# EAGLE design QuackDrive no usb power (EAGLE 9.5.1)
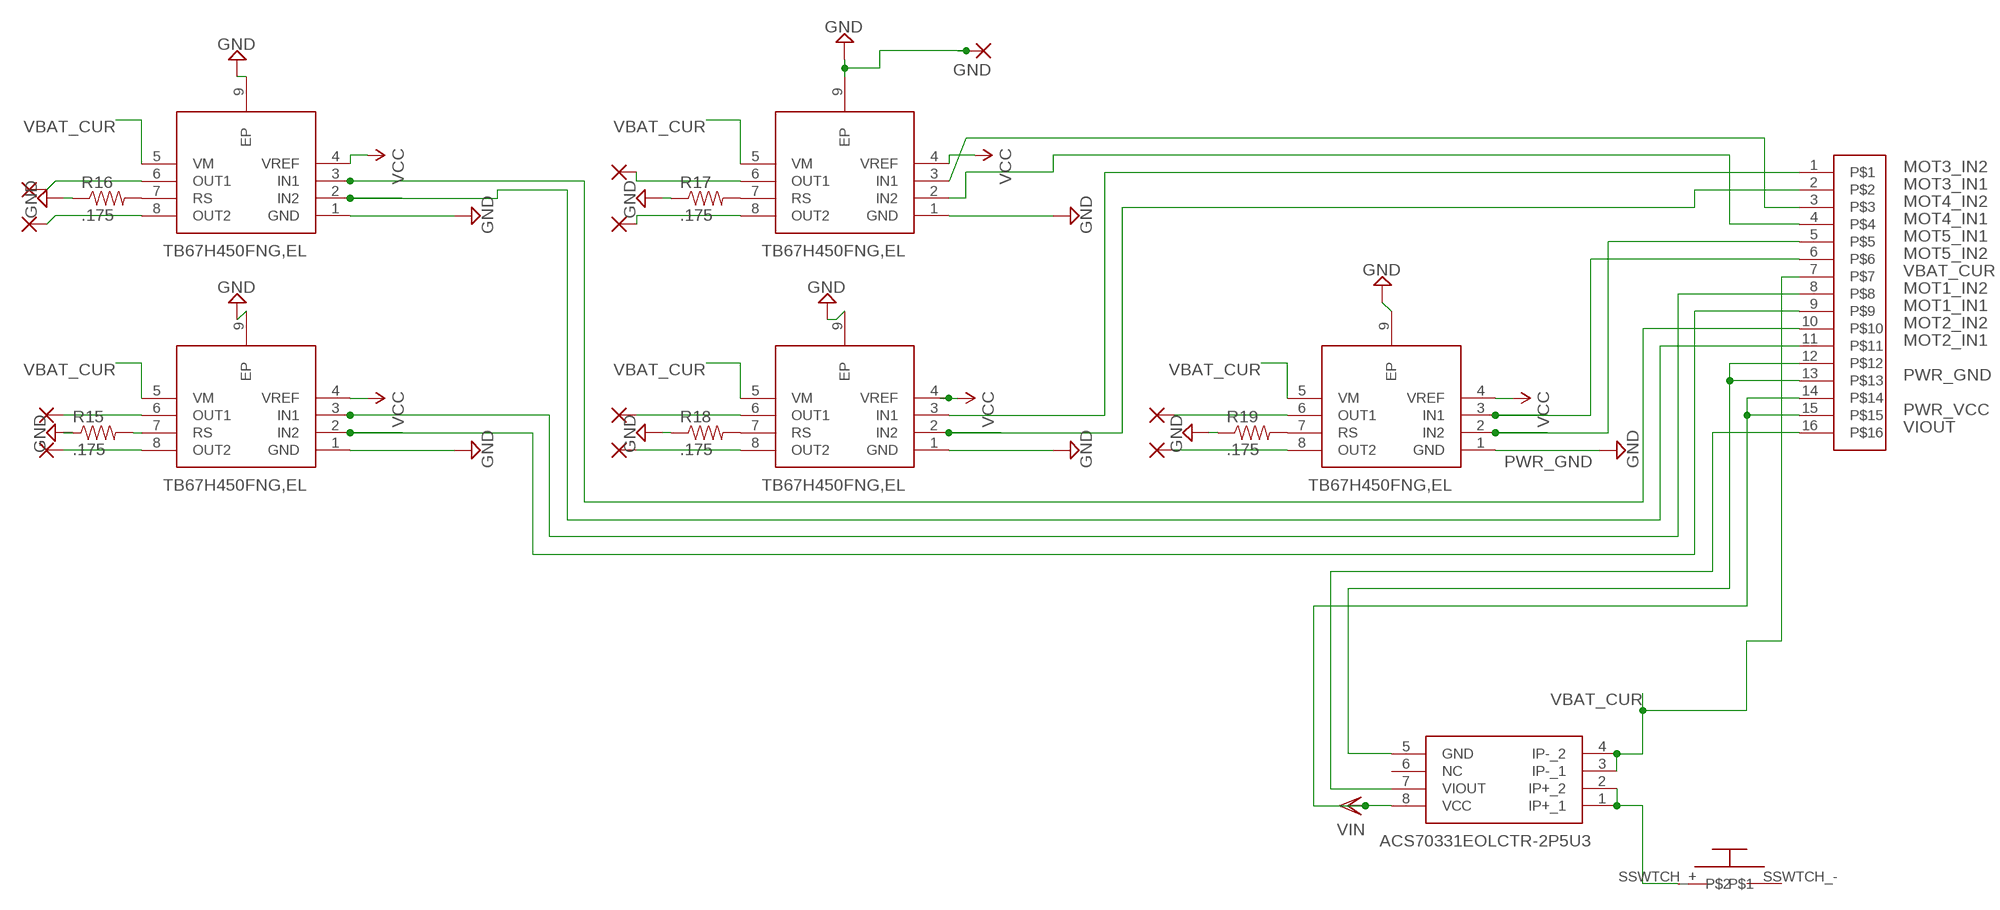
[diagram p0: schematic, sheet 1, part 1 of 2]
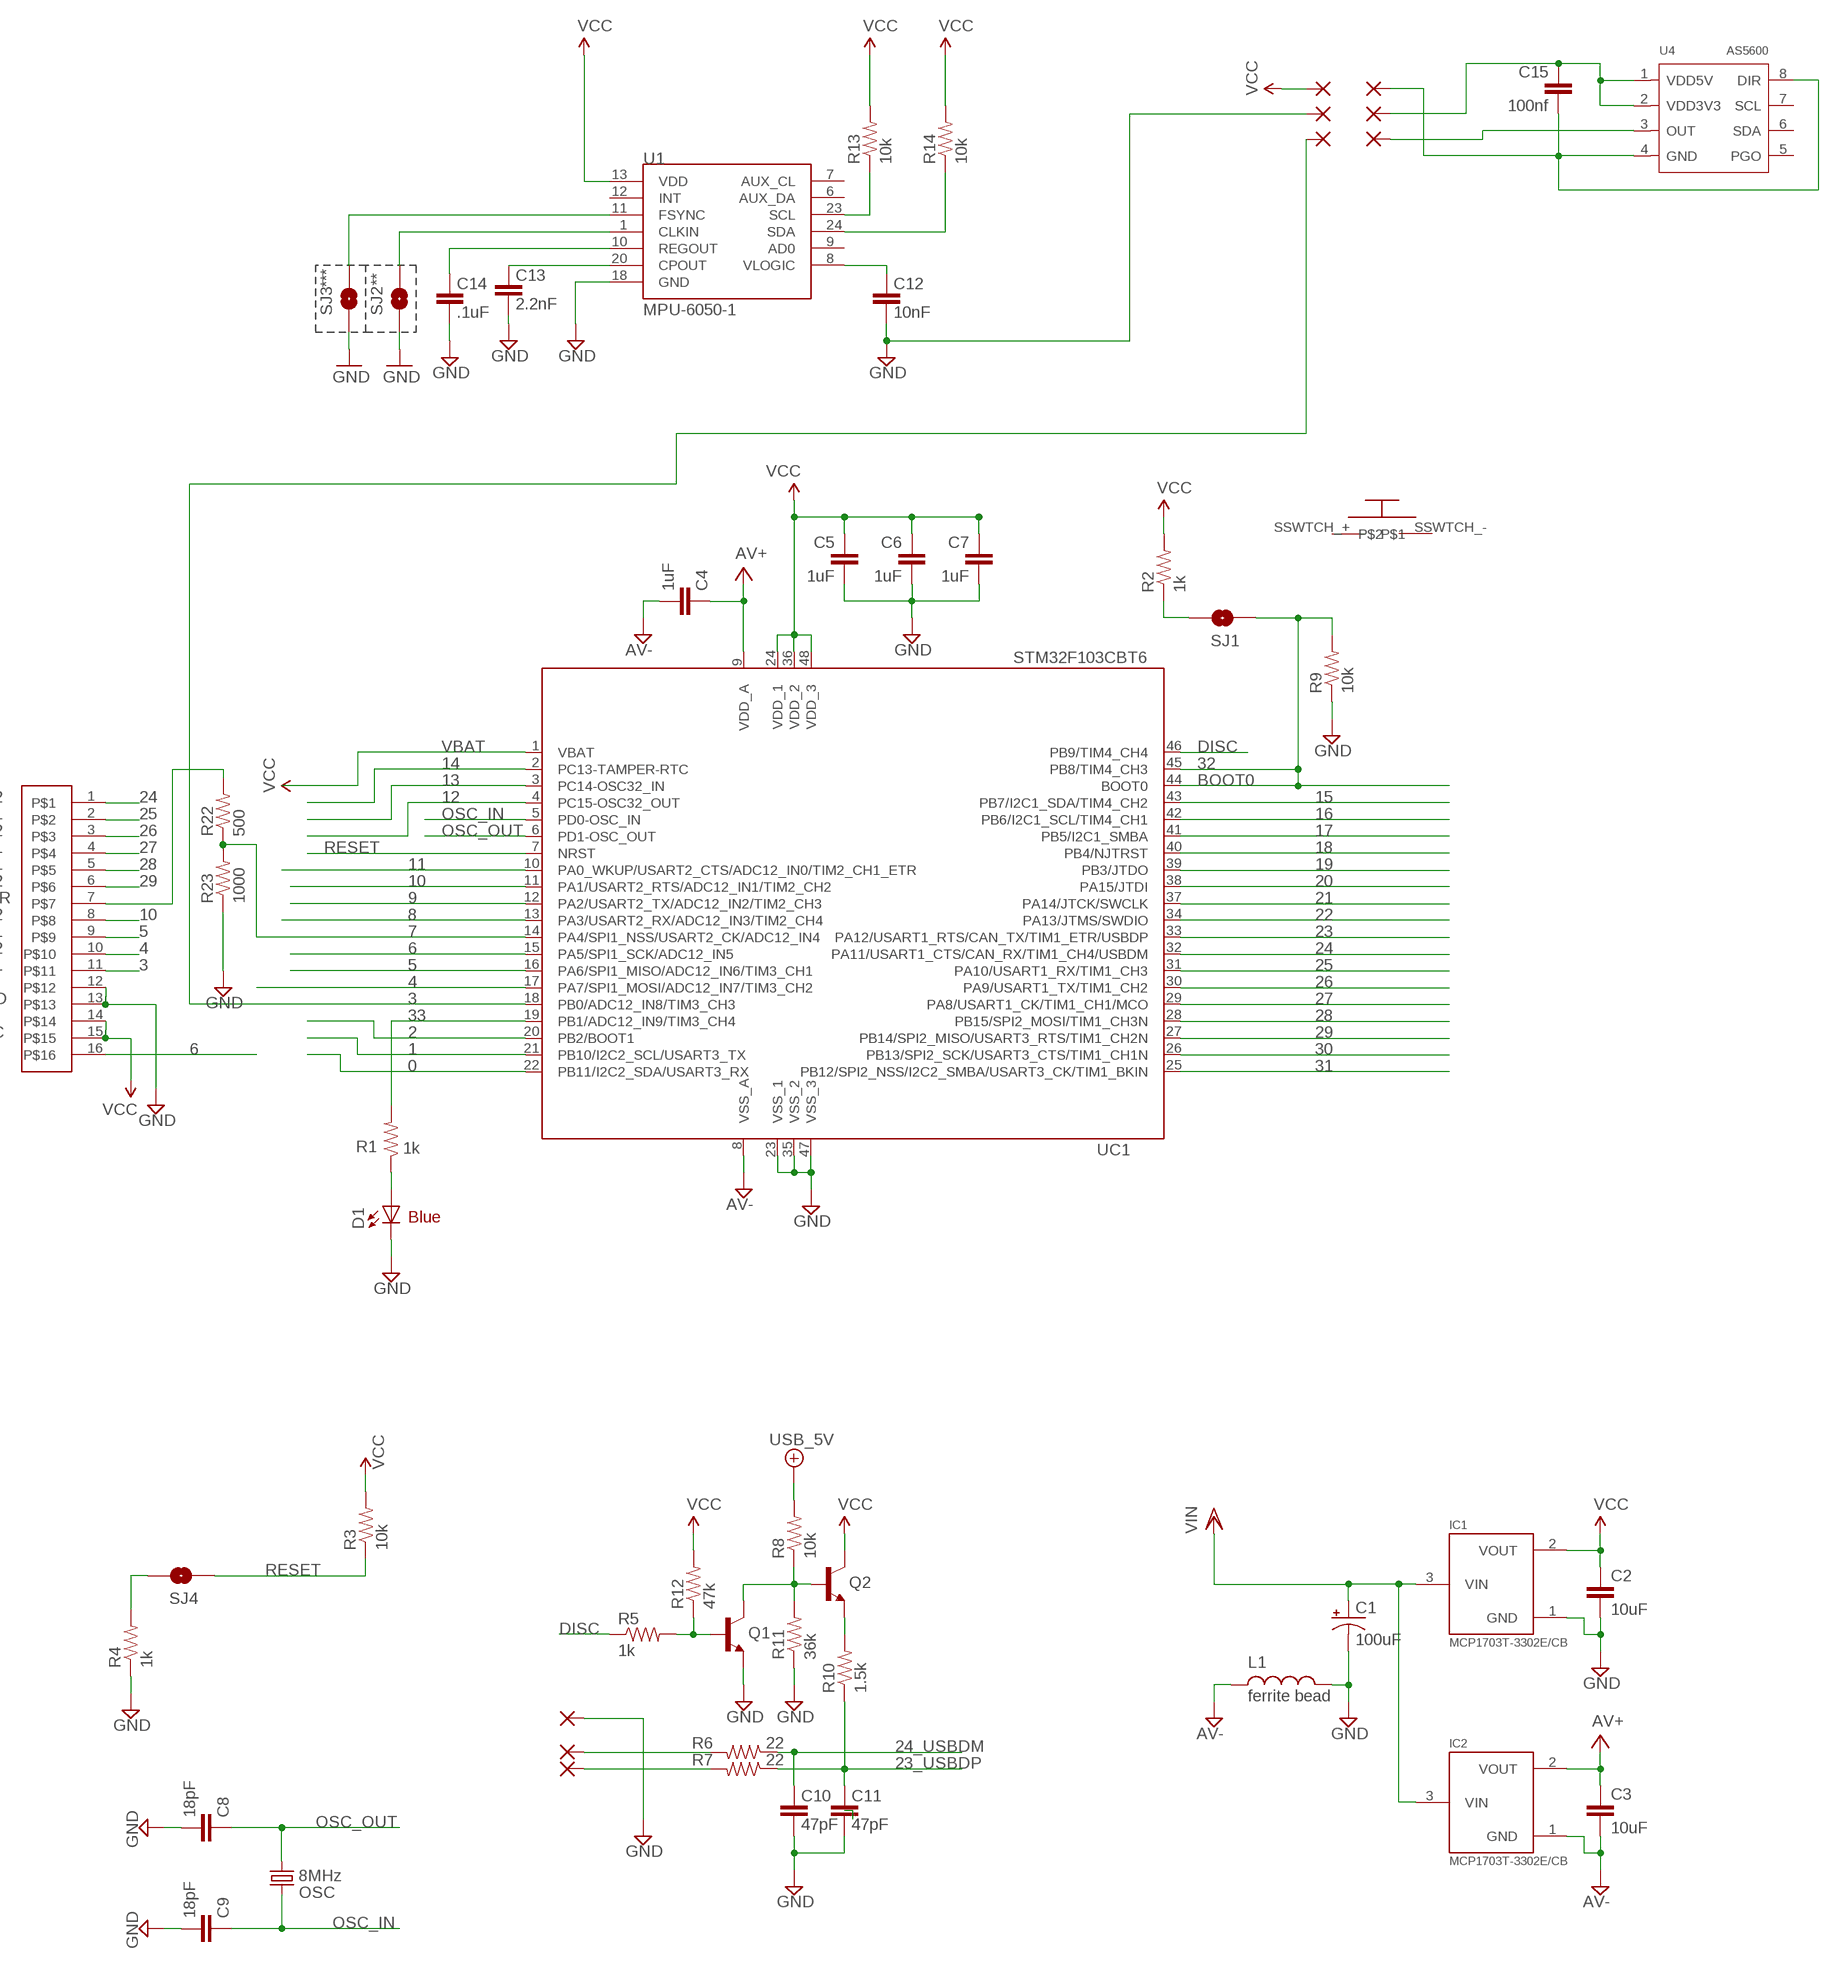
[diagram p1: schematic, sheet 1, part 2 of 2]

## Parts
C1  100uF  CAP_POL1206  [EIA3216]
C2  10uF  CAP0805  [0805]
C3  10uF  CAP0805  [0805]
C4  1uF  CAP0402  [C0402]
C5  1uF  CAP0402  [C0402]
C6  1uF  CAP0402  [C0402]
C7  1uF  CAP0402  [C0402]
C8  18pF  CAP0402  [C0402]
C9  18pF  CAP0402  [C0402]
C10  47pF  CAP0402  [C0402]
C11  47pF  CAP0402  [C0402]
C12  10nF  CAP0402  [C0402]
C13  2.2nF  CAP0402  [C0402]
C14  .1uF  CAP0402  [C0402]
C15  100nf  CAP0402  [C0402]
D1  Blue  LED1206  [LED-1206]
GND  SMD5  [SMD2,54-5,08]
IC1  MCP1703T-3302E/CB  MCP1700T  [SOT23]
IC2  MCP1703T-3302E/CB  MCP1700T  [SOT23]
IC4  TB67H450FNG,EL  [SOIC127P600X175-9N]
IC5  ACS70331EOLCTR-2P5U3  [SOIC127P600X175-8N]
IC6  TB67H450FNG,EL  [SOIC127P600X175-9N]
IC8  TB67H450FNG,EL  [SOIC127P600X175-9N]
IC10  TB67H450FNG,EL  [SOIC127P600X175-9N]
IC12  TB67H450FNG,EL  [SOIC127P600X175-9N]
L1  ferrite bead  INDUCTOR0603  [0603]
OSC  8MHz  CRYSTAL5X3  [CRYSTAL-SMD-5X3]
PAD1  WIREPADSMD1,27-254  [SMD1,27-2,54]
PAD2  WIREPADSMD1,27-254  [SMD1,27-2,54]
PAD3  WIREPADSMD1,27-254  [SMD1,27-2,54]
PAD4  SMD2  [SMD1,27-2,54]
PAD5  WIREPADSMD1,27-254  [SMD1,27-2,54]
PAD6  WIREPADSMD1,27-254  [SMD1,27-2,54]
PAD7  SMD2  [SMD1,27-2,54]
PAD8  WIREPADSMD1,27-254  [SMD1,27-2,54]
PAD9  WIREPADSMD1,27-254  [SMD1,27-2,54]
PAD10  WIREPADSMD1,27-254  [SMD1,27-2,54]
PAD11  WIREPADSMD1,27-254  [SMD1,27-2,54]
PAD12  WIREPADSMD1,27-254  [SMD1,27-2,54]
PAD13  SMD2  [SMD1,27-2,54]
PAD14  SMD2  [SMD1,27-2,54]
PAD15  SMD2  [SMD1,27-2,54]
PAD16  SMD2  [SMD1,27-2,54]
PAD17  SMD2  [SMD1,27-2,54]
PAD19  SMD2  [SMD1,27-2,54]
PAD20  SMD2  [SMD1,27-2,54]
Q1  NPN-BJT  TRANSISTOR_NPNSOT23  [SOT23]
Q2  NPN-BJT  TRANSISTOR_NPNSOT23  [SOT23]
R1  1k  RESISTOR0402  [C0402]
R2  1k  RESISTOR0402  [C0402]
R3  10k  RESISTOR0402  [C0402]
R4  1k  RESISTOR0402  [C0402]
R5  1k  RESISTOR0402  [C0402]
R6  22  RESISTOR0402  [C0402]
R7  22  RESISTOR0402  [C0402]
R8  10k  RESISTOR0402  [C0402]
R9  10k  RESISTOR0402  [C0402]
R10  1.5k  RESISTOR0402  [C0402]
R11  36k  RESISTOR0402  [C0402]
R12  47k  RESISTOR0402  [C0402]
R13  10k  RESISTOR0402  [C0402]
R14  10k  RESISTOR0402  [C0402]
R15  .175  RESISTOR0402  [C0402]
R16  .175  RESISTOR0402  [C0402]
R17  .175  RESISTOR0402  [C0402]
R18  .175  RESISTOR0402  [C0402]
R19  .175  RESISTOR0402  [C0402]
R22  500  RESISTOR0402  [C0402]
R23  1000  RESISTOR0402  [C0402]
SJ1  SOLDERJUMPERTRACE  [SJ_2S-TRACE]
SJ2  SOLDERJUMPERTRACE  [SJ_2S-TRACE]
SJ3  SOLDERJUMPERTRACE  [SJ_2S-TRACE]
SJ4  SOLDERJUMPERTRACE  [SJ_2S-TRACE]
U1  MPU-6050-1  [QFN-24-4MM2]
U4  AS5600  SENSOR-AS5600  [SOIC8-1.27-5X4MM]
U$1  WM8952DKR  [SOP80P420X355-16N]
U$2  SSWTCH  [SSWITCH]
U$3  WM8952DKR  [SOP80P420X355-16N]
U$4  SSWTCH  [SSWITCH]
UC1  STM32F103CBT6  STM32F103CB  [LQFP48]

## Nets
0: UC1.22(PB11/I2C2_SDA/USART3_RX)
1: UC1.21(PB10/I2C2_SCL/USART3_TX)
2: UC1.20(PB2/BOOT1)
3: PAD14.1(P) U$3.11 UC1.18(PB0/ADC12_IN8/TIM3_CH3)
4: U$3.10 UC1.17(PA7/SPI1_MOSI/ADC12_IN7/TIM3_CH2)
5: U$3.9 UC1.16(PA6/SPI1_MISO/ADC12_IN6/TIM3_CH1)
6: U$3.16 UC1.15(PA5/SPI1_SCK/ADC12_IN5)
7: R22.1 R23.2 UC1.14(PA4/SPI1_NSS/USART2_CK/ADC12_IN4)
8: UC1.13(PA3/USART2_RX/ADC12_IN3/TIM2_CH4)
9: UC1.12(PA2/USART2_TX/ADC12_IN2/TIM2_CH3)
10: U$3.8 UC1.11(PA1/USART2_RTS/ADC12_IN1/TIM2_CH2)
11: UC1.10(PA0_WKUP/USART2_CTS/ADC12_IN0/TIM2_CH1_ETR)
12: UC1.4(PC15-OSC32_OUT)
13: UC1.3(PC14-OSC32_IN)
14: UC1.2(PC13-TAMPER-RTC)
15: UC1.43(PB7/I2C1_SDA/TIM4_CH2)
16: UC1.42(PB6/I2C1_SCL/TIM4_CH1)
17: UC1.41(PB5/I2C1_SMBA)
18: UC1.40(PB4/NJTRST)
19: UC1.39(PB3/JTDO)
20: UC1.38(PA15/JTDI)
21: UC1.37(PA14/JTCK/SWCLK)
22: UC1.34(PA13/JTMS/SWDIO)
23: UC1.33(PA12/USART1_RTS/CAN_TX/TIM1_ETR/USBDP)
23_USBDP: C11.2 R7.1 R10.1
24: U$3.1 UC1.32(PA11/USART1_CTS/CAN_RX/TIM1_CH4/USBDM)
24_USBDM: C10.2 R6.1
25: U$3.2 UC1.31(PA10/USART1_RX/TIM1_CH3)
26: U$3.3 UC1.30(PA9/USART1_TX/TIM1_CH2)
27: U$3.4 UC1.29(PA8/USART1_CK/TIM1_CH1/MCO)
28: U$3.5 UC1.28(PB15/SPI2_MOSI/TIM1_CH3N)
29: U$3.6 UC1.27(PB14/SPI2_MISO/USART3_RTS/TIM1_CH2N)
30: UC1.26(PB13/SPI2_SCK/USART3_CTS/TIM1_CH1N)
31: UC1.25(PB12/SPI2_NSS/I2C2_SMBA/USART3_CK/TIM1_BKIN)
32: R9.2 SJ1.1 UC1.44(BOOT0) UC1.45(PB8/TIM4_CH3)
33: R1.2 UC1.19(PB1/ADC12_IN9/TIM3_CH4)
+5V/2: R8.2 ; supply symbol labelled USB_5V
AV+: C3.1 C4.1 IC2.2(VOUT) UC1.9(VDD_A)
AV-: C3.2 C4.2 IC2.1(GND) L1.1 UC1.8(VSS_A)
CLKIN1: SJ2.2 U1.1(CLKIN)
DISC: R5.1 UC1.46(PB9/TIM4_CH4)
FSYNC1: SJ3.2 U1.11(FSYNC)
GND: C1.C(-) C2.2 C5.2 C6.2 C7.2 C8.2 C9.2 C10.1 C11.1 C12.1 C13.1 C14.1 D1.C IC1.1(GND) L1.2 PAD15.1(P) PAD17.1(P) Q1.2(E) R4.1 R9.1 R11.1 R23.1 SJ2.1 SJ3.1 U1.18(GND) U$3.12 U$3.13 UC1.23(VSS_1) UC1.35(VSS_2) UC1.47(VSS_3)
MOT1_IN1: IC4.2(IN2) U$1.9
MOT1_IN2: IC4.3(IN1) U$1.8
MOT2_IN1: IC6.2(IN2) U$1.11
MOT2_IN2: IC6.3(IN1) U$1.10
MOT3_IN1: IC8.2(IN2) U$1.2
MOT3_IN2: IC8.3(IN1) U$1.1
MOT4_IN1: IC10.2(IN2) U$1.4
MOT4_IN2: IC10.3(IN1) U$1.3
MOT5_IN1: IC12.2(IN2) U$1.5
MOT5_IN2: IC12.3(IN1) U$1.6
N$1: R2.1 SJ1.2
N$2: D1.A R1.1
N$3: R13.1 U1.23(SCL)
N$4: R4.2 SJ4.2
N$5: R14.1 U1.24(SDA)
N$7: C12.2 U1.8(VLOGIC)
N$8: C13.2 U1.20(CPOUT)
N$9: C14.2 U1.10(REGOUT)
N$10: PAD13.1(P) U4.3(OUT)
N$11: IC12.8(OUT2) PAD5.1(P)
N$12: IC6.7(RS) R16.2
N$13: IC12.6(OUT1) PAD6.1(P)
N$14: IC8.6(OUT1) PAD2.1(P)
N$15: IC8.8(OUT2) PAD1.1(P)
N$16: C15.1 PAD7.1(P) U4.1(VDD5V) U4.2(VDD3V3)
N$17: IC10.6(OUT1) PAD8.1(P)
N$18: IC10.8(OUT2) PAD3.1(P)
N$19: IC6.6(OUT1) PAD12.1(P)
N$20: IC6.8(OUT2) PAD11.1(P)
N$21: IC4.6(OUT1) PAD10.1(P)
N$22: IC4.8(OUT2) PAD9.1(P)
N$23: IC10.7(RS) R17.2
N$24: IC8.7(RS) R18.2
N$25: IC12.7(RS) R19.2
N$26: IC4.7(RS) R15.2
N$28: R22.2 U$3.7
N$29: C15.2 PAD4.1(P) U4.4(GND) U4.8(DIR)
N$51: Q2.2(E) R10.2
N$59: PAD19.1(P) R6.2
N$60: PAD20.1(P) R7.2
N$71: Q1.3(C) Q2.1(B) R8.1 R11.2
N$73: Q1.1(B) R5.2 R12.1
OSC_IN: C9.1 OSC.3 UC1.5(PD0-OSC_IN)
OSC_OUT: C8.1 OSC.1 UC1.6(PD1-OSC_OUT)
PWR_GND: GND.1(P) IC4.1(GND) IC4.9(EP) IC5.5(GND) IC6.1(GND) IC6.9(EP) IC8.1(GND) IC8.9(EP) IC10.1(GND) IC10.9(EP) IC12.1(GND) IC12.9(EP) R15.1 R16.1 R17.1 R18.1 R19.1 U$1.12 U$1.13 ; supply symbol labelled GND
PWR_VCC: IC4.4(VREF) IC5.8(VCC) IC6.4(VREF) IC8.4(VREF) IC10.4(VREF) IC12.4(VREF) U$1.14 U$1.15 ; supply symbol labelled VIN, VCC
RESET: R3.1 SJ4.1 UC1.7(NRST)
VBAT: UC1.1(VBAT)
VBAT_CUR: IC4.5(VM) IC5.3(IP-_1) IC5.4(IP-_2) IC6.5(VM) IC8.5(VM) IC10.5(VM) IC12.5(VM) U$1.7
VBAT_IN: IC5.1(IP+_1) IC5.2(IP+_2) U$2.SSWTCH_+
VCC: C2.1 C5.1 C6.1 C7.1 IC1.2(VOUT) PAD16.1(P) Q2.3(C) R2.2 R3.2 R12.2 R13.2 R14.2 U1.13(VDD) U$3.14 U$3.15 UC1.24(VDD_1) UC1.36(VDD_2) UC1.48(VDD_3)
VIN: C1.A(+) IC1.3(VIN) IC2.3(VIN)
VIOUT: IC5.7(VIOUT) U$1.16
Unconnected: IC5.6(NC) U1.6(AUX_DA) U1.7(AUX_CL) U1.9(AD0) U1.12(INT) U4.5(PGO) U4.6(SDA) U4.7(SCL) U$2.SSWTCH_- U$4.SSWTCH_+ U$4.SSWTCH_-

## Notes on the sheet
- *** | **
- BOOT0
- Blue

## Library data of the parts
C1 = SparkFun3:CAP_POL: Capacitor Polarized These are standard SMD and PTH capacitors. Normally 10uF, 47uF, and 100uF in electrolytic and tantalum varieties. Always verify the external diameter of the through hole cap, it varies with capacity, voltage, and manufacturer. The EIA devices should be standard.
C2 C3 = SparkFun2:CAP: Capacitor Standard 0603 ceramic capacitor, and 0.1" leaded capacitor.
C4-C15 = SparkFun:CAP: Capacitor Standard 0603 ceramic capacitor, and 0.1" leaded capacitor.
D1 = SparkFun:LED: LEDs Standard schematic elements and footprints for 5mm, 3mm, 1206, and 0603 sized LEDs. 5mm - Spark Fun Electronics SKU : COM-00529 (and others)
GND = wirepad:SMD5: SMD PAD
IC1 IC2 = okie:MCP1700T
IC4 IC6 IC8 IC10 IC12 = TB67H450FNG_EL:TB67H450FNG,EL: Motor / Motion / Ignition Controllers & Drivers Brushed Motor Driver IC, 50V, 3.5A, TSSOP8 Package, PB-FREE Source: Datasheet <http://toshiba.semicon-storage.com/info/docget.jsp?did=65346&prodName=TB67H450FNG>; DESCRIPTION: Motor / Motion / Ignition Controllers & Drivers Brushed Motor Driver IC, 50V, 3.5A, TSSOP8 Package, PB-FREE; HEIGHT: 1.75mm; MANUFACTURER_NAME: Toshiba; MANUFACTURER_PART_NUMBER: TB67H450FNG,EL; MOUSER_PART_NUMBER: 757-TB67H450FNGEL; MOUSER_PRICE-STOCK: https://www.mouser.com/Search/Refine.aspx?Keyword=757-TB67H450FNGEL
IC5 = ACS70331EOLCTR-2P5U3:ACS70331EOLCTR-2P5U3: High Sensitivity, 1 MHz, GMR-Based Current Sensor IC , SOIC-8 Source: Datasheet <https://www.allegromicro.com/~/media/Files/Datasheets/ACS70331-Datasheet.ashx>; DESCRIPTION: High Sensitivity, 1 MHz, GMR-Based Current Sensor IC , SOIC-8; HEIGHT: 1.75mm; MANUFACTURER_NAME: Allegro Microsystems; MANUFACTURER_PART_NUMBER: ACS70331EOLCTR-2P5U3
L1 = SparkFun3:INDUCTOR: Inductors Basic Inductor/Choke - 0603 and 1206. Footprints are not proven and vary greatly between part numbers.
OSC = SparkFun2:CRYSTAL: Crystals Various standard crystals. Proven footprints. Spark Fun Electronics SKU : COM-00534
PAD1-PAD3 PAD5 PAD6 PAD8-PAD12 = wirepad:WIREPAD: Wire PAD connect wire on PCB
PAD4 PAD7 PAD13-PAD17 PAD19 PAD20 = wirepad:SMD2: SMD PAD
Q1 Q2 = SparkFun2:TRANSISTOR_NPN: Transistor NPN BJT configuration in SOT23 package. MMBT2222 is the common NPN we use. Double check BCE configuration again layout.
R1-R19 R22 R23 = SparkFun:RESISTOR: Resistor Basic schematic elements and footprints for 0603, 1206, and PTH 1/10th watt (small) resistors.
SJ1-SJ4 = SparkFun:SOLDERJUMPER: Solder Jumper Standard SMD solder jumper. Used to automate production. Two varients : Normally Open and Normally Closed are the same, but have different paste layers. NC will have a large amount of paste and should jumper during reflow.
U1 = Testing:MPU-6050
U4 = Sensor:SENSOR-AS5600
U$1 = WM8952DKR:WM8952DKR
U$2 = Safet switch:SSWTCH
U$3 = WM8952DKR FW:WM8952DKR
U$4 = Safet switch other side:SSWTCH
UC1 = stm32:STM32F103CB

## Net classes
0 Default: width 0.203 mm

## Board
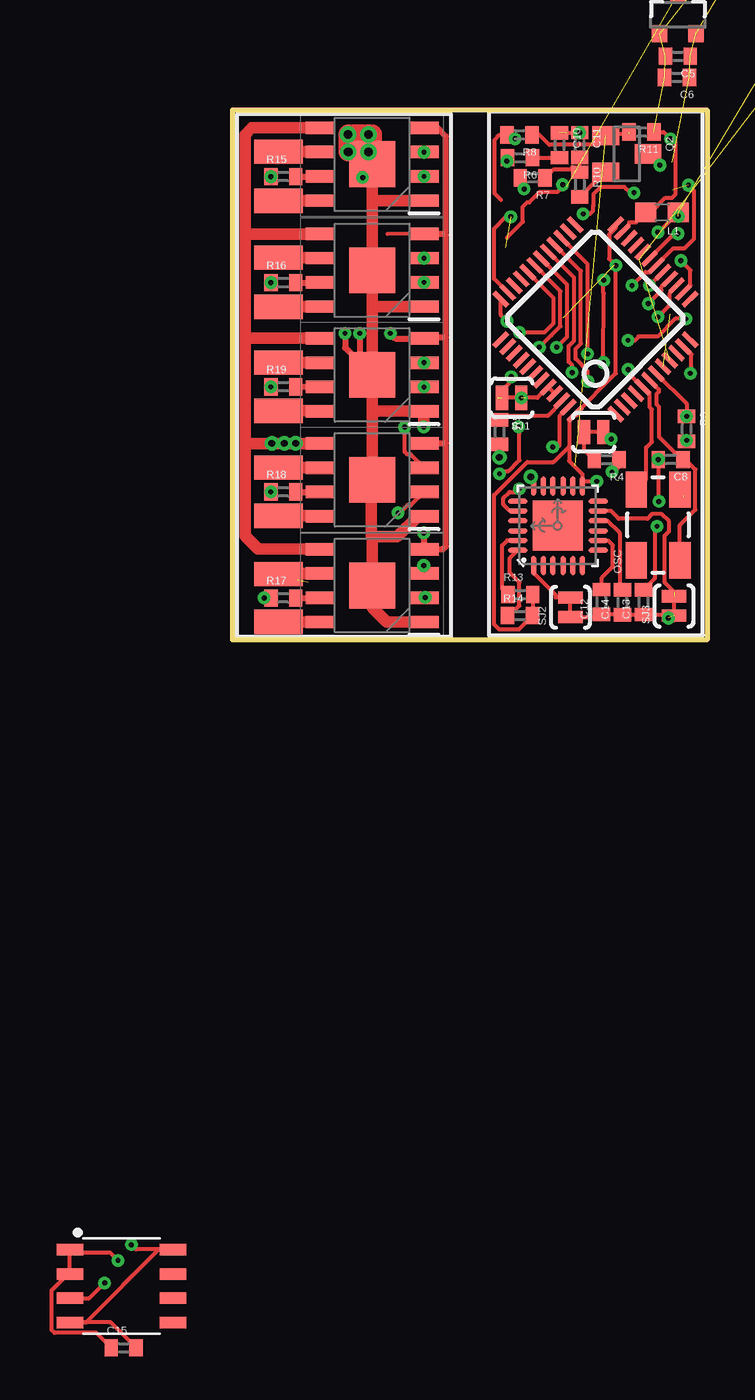
[diagram p2: board, top side]
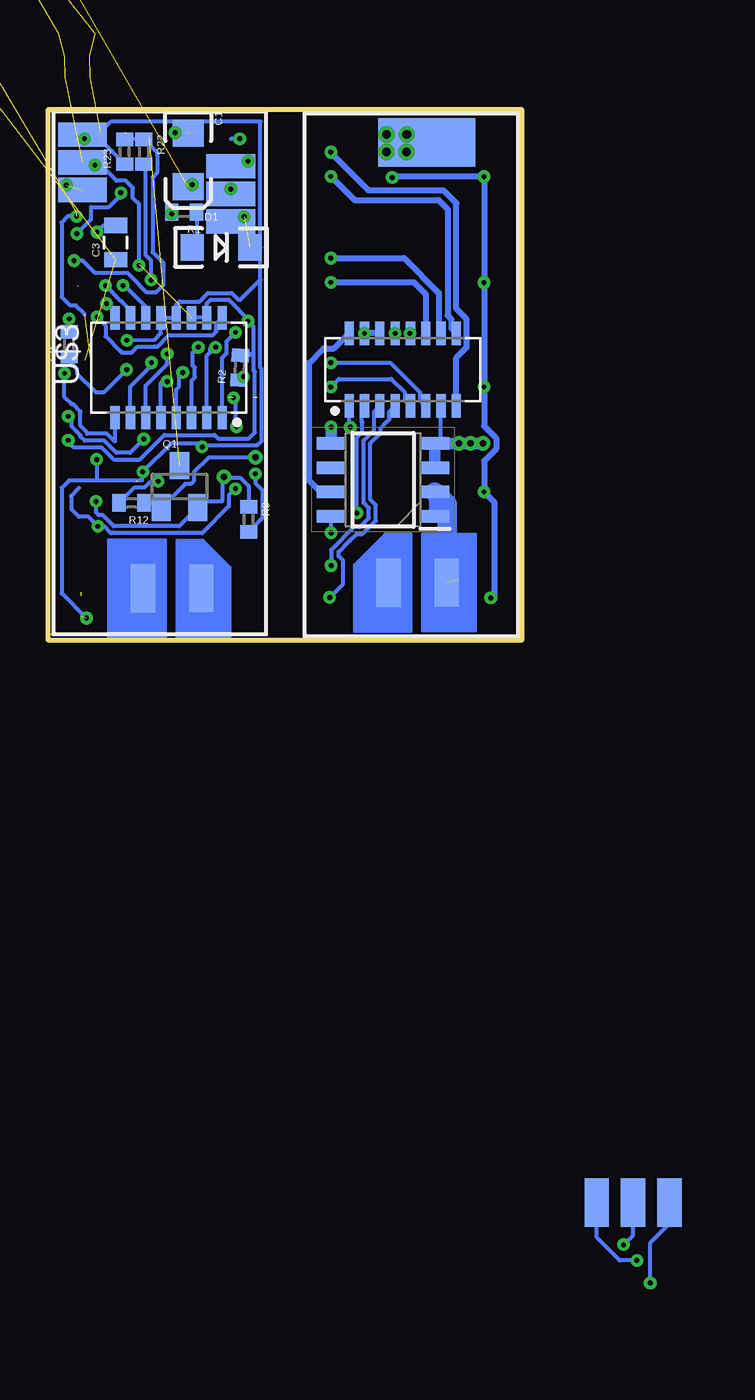
[diagram p3: board, bottom side, seen from below]

Size 24.82 x 27.75 mm. Coordinates in mm from the lower left corner, seen from the top.
Outline: 0,27.75 24.82,27.75 24.82,0 0,0 0,27.75
Copper layers (1*16): Top 0.07mm / dielectric 0.8mm / Bottom 0.07mm
Design rules "default *": minimum track width 6mil, minimum drill 10mil, track to track 6mil, track to pad 6mil, pad to pad 6mil, via to via 6mil, smd to smd 0mil, copper to edge 6mil, drill to drill 6mil, minimum pad ring 5mil, minimum via ring 8mil, stop-mask expansion 4mil, vias tented up to drill 50mil, thermal gap 10mil

### Footprints (pad centres in the part's own frame; a part is rotated, then mirrored left to right if it is on the bottom)
EIA3216 = smd 1.4 x 1.6: A 1.4,0; C -1.4,0
0805 = smd 0.8 x 1.2: 1 -0.9,0; 2 0.9,0
C0402 = smd 0.7 x 0.9: 1 -0.65,0; 2 0.65,0
LED-1206 = smd 1.2 x 1.4: A -1.5,0; C 1.5,0
SMD2,54-5,08 = smd 2.54 x 5.08: 1 0,0
SOT23 = smd 0.8 x 0.9: 1 -0.95,-1; 2 0.95,-1; 3 0,1.1
SOIC127P600X175-9N = smd 1.525 x 0.65: 1 -2.712,1.905; 2 -2.712,0.635; 3 -2.712,-0.635; 4 -2.712,-1.905; 5 2.712,-1.905; 6 2.712,-0.635; 7 2.712,0.635; 8 2.712,1.905 | smd 2.39 x 2.39: 9 0,0
SOIC127P600X175-8N = smd 1.525 x 0.65: 1 -2.712,1.905; 2 -2.712,0.635; 3 -2.712,-0.635; 4 -2.712,-1.905; 5 2.712,-1.905; 6 2.712,-0.635; 7 2.712,0.635; 8 2.712,1.905
0603 = smd 1.1 x 1: 1 -0.85,0; 2 0.85,0
CRYSTAL-SMD-5X3 = smd 1.9 x 1.1: 1 -1.85,-1.15; 2 1.85,-1.15; 3 1.85,1.15; 4 -1.85,1.15
SMD1,27-2,54 = smd 1.27 x 2.54: 1 0,0
SOT23' = smd 1 x 1.4: 1 -0.95,-1.1; 2 0.95,-1.1; 3 0,1.1
SJ_2S-TRACE = smd 0.635 x 1.27: 1 -0.508,0; 2 0.508,0
QFN-24-4MM2 = smd 1.016 x 0.254: 1 -2.066,1.257; 2 -2.066,0.75; 3 -2.066,0.247; 4 -2.066,-0.287; 5 -2.066,-0.792; 6 -2.066,-1.297; 13 2.086,-1.297; 14 2.086,-0.792; 15 2.086,-0.287; 16 2.086,0.247; 17 2.086,0.75; 18 2.086,1.257 | smd 0.254 x 1.016: 7 -1.267,-2.122; 8 -0.762,-2.122; 9 -0.258,-2.122; 10 0.278,-2.122; 11 0.78,-2.122; 12 1.287,-2.122; 19 1.287,2.082; 20 0.78,2.082; 21 0.278,2.082; 22 -0.258,2.082; 23 -0.762,2.082; 24 -1.267,2.082 | smd 2.616 x 2.616: P$1 0.02,-0.01
SOIC8-1.27-5X4MM = smd 0.6 x 1.4: 1 -1.905,-2.7; 2 -0.635,-2.7; 3 0.635,-2.7; 4 1.905,-2.7; 5 1.905,2.7; 6 0.635,2.7; 7 -0.635,2.7; 8 -1.905,2.7
SOP80P420X355-16N = smd 1.212 x 0.484: 1 -1.9,2.8; 2 -1.9,2; 3 -1.9,1.2; 4 -1.9,0.4; 5 -1.9,-0.4; 6 -1.9,-1.2; 7 -1.9,-2; 8 -1.9,-2.8; 9 1.9,-2.8; 10 1.9,-2; 11 1.9,-1.2; 12 1.9,-0.4; 13 1.9,0.4; 14 1.9,1.2; 15 1.9,2; 16 1.9,2.8
SSWITCH = smd 1.25 x 2.5: SSWTCH_+ 0,0 | smd 1.27 x 2.54: SSWTCH_- 3.048,0
SOP80P420X355-16N' = smd 1.212 x 0.484: 1 -3.304,-2.8; 2 -3.304,-2; 3 -3.304,-1.2; 4 -3.304,-0.4; 5 -3.304,0.4; 6 -3.304,1.2; 7 -3.304,2; 8 -3.304,2.8; 9 1.91,2.8; 10 1.91,2; 11 1.91,1.2; 12 1.91,0.4; 13 1.91,-0.4; 14 1.91,-1.2; 15 1.91,-2; 16 1.91,-2.8
LQFP48 = smd 0.254 x 1: 1 -2.75,-4.25; 2 -2.25,-4.25; 3 -1.75,-4.25; 4 -1.25,-4.25; 5 -0.75,-4.25; 6 -0.25,-4.25; 7 0.25,-4.25; 8 0.75,-4.25; 9 1.25,-4.25; 10 1.75,-4.25; 11 2.25,-4.25; 12 2.75,-4.25; 25 2.75,4.25; 26 2.25,4.25; 27 1.75,4.25; 28 1.25,4.25; 29 0.75,4.25; 30 0.25,4.25; 31 -0.25,4.25; 32 -0.75,4.25; 33 -1.25,4.25; 34 -1.75,4.25; 35 -2.25,4.25; 36 -2.75,4.25 | smd 1 x 0.254: 13 4.25,-2.75; 14 4.25,-2.25; 15 4.25,-1.75; 16 4.25,-1.25; 17 4.25,-0.75; 18 4.25,-0.25; 19 4.25,0.25; 20 4.25,0.75; 21 4.25,1.25; 22 4.25,1.75; 23 4.25,2.25; 24 4.25,2.75; 37 -4.25,2.75; 38 -4.25,2.25; 39 -4.25,1.75; 40 -4.25,1.25; 41 -4.25,0.75; 42 -4.25,0.25; 43 -4.25,-0.25; 44 -4.25,-0.75; 45 -4.25,-1.25; 46 -4.25,-1.75; 47 -4.25,-2.25; 48 -4.25,-2.75

### Placement (x,y rotation side)
C1  17.48,25.12 270 bottom
C2  28.53,36.71 90 top  (outside the outline)
C3  21.28,20.8 90 bottom
C4  29.03,30.9 180 top  (outside the outline)
C5  23.29,30.54 180 top
C6  23.25,29.45 180 top
C7  26.79,36.74 90 top  (outside the outline)
C8  22.92,9.45 180 top
C9  23.71,15.48 90 bottom
C10  17.11,25.89 270 top
C11  18.16,25.9 270 top
C12  19.3,1.99 90 top
C13  21.5,1.98 90 top
C14  20.39,1.97 90 top
C15  -5.7,-37.05 0 top  (outside the outline)
D1  15.76,20.54 0 bottom
GND  5,26.05 90 bottom
IC1  23.29,32.73 0 top  (outside the outline)
IC2  29.07,33.02 0 top  (outside the outline)
IC4  7.3,24.9 180 top
IC5  7.28,8.38 180 bottom
IC6  7.3,19.35 180 top
IC8  7.3,8.38 180 top
IC10  7.3,2.84 180 top
IC12  7.3,13.88 180 top
L1  22.47,22.38 180 top
OSC  22.25,6.02 90 top
PAD1  2.4,6.5 90 top
PAD2  2.4,9.02 270 top
PAD3  2.4,0.95 90 top
PAD4  -5.8,-29.45 0 bottom  (outside the outline)
PAD5  2.4,11.99 90 top
PAD6  2.4,14.51 90 top
PAD7  -3.9,-29.45 0 bottom  (outside the outline)
PAD8  2.4,3.45 90 top
PAD9  2.4,22.98 270 top
PAD10  2.4,25.55 270 top
PAD11  2.4,17.44 90 top
PAD12  2.4,20.01 270 top
PAD13  -7.7,-29.45 0 bottom  (outside the outline)
PAD14  23,23.55 270 bottom
PAD15  23,26.45 270 bottom
PAD16  23,25 270 bottom
PAD17  15.25,21.9 270 bottom
PAD19  15.25,24.8 270 bottom
PAD20  15.25,23.35 270 bottom
Q1  NPN-BJT  [SOT23']  17.93,8.02 0 bottom
Q2  NPN-BJT  [SOT23']  20.62,25.44 270 top
R1  17.69,22.38 180 bottom
R2  14.79,14.25 87 bottom
R3  23.75,11.05 270 top
R4  19.57,9.44 180 top
R5  13.96,10.88 270 top
R6  15.04,25.24 180 top
R7  15.7,24.18 180 top
R8  15.01,26.43 180 top
R9  14.32,6.32 270 bottom
R10  18.16,23.83 270 top
R11  21.39,26.59 180 top
R12  20.44,7.18 180 bottom
R13  15.05,2.38 0 top
R14  15.04,1.27 0 top
R15  2.65,24.25 0 top
R16  2.65,18.7 0 top
R17  2.65,2.2 0 top
R18  2.65,7.75 0 top
R19  2.65,13.25 0 top
R22  19.8,25.55 270 bottom
R23  20.8,25.55 90 bottom
SJ1  14.6,12.68 180 top
SJ2  17.68,1.71 90 top
SJ3  23.1,1.78 90 top
SJ4  18.89,10.88 180 top
U1  17,5.97 90 top
U4  -5.82,-33.81 270 top  (outside the outline)
U$1  6.25,14.15 90 bottom
U$2  3.95,3 180 bottom
U$3  WM8952DKR  [SOP80P420X355-16N']  18.5,14.95 90 bottom
U$4  16.8,2.7 180 bottom
UC1  18.98,16.78 45 top

### Tracks (layer width: path | path; a pad name or v marks a point on that pad's centre or on a via)
3  (via drill 0.25)  (1 unrouted)
  Top 0.203: v20.89,18.55 21.6,19.26 21.85,19.26 22.16,19.57 UC1.18 23.06,20.5 23.65,20.5 24.15,21 24.15,23.5 v23.85,23.8
  Bottom 0.203: U$3.11 19.7,17.45 20.8,18.55 v20.89,18.55
4  (via drill 0.25)
  Top 0.203: v21.8,18.55 22.5,19.25 UC1.17
  Bottom 0.203: 20.5,17.35 U$3.10 20.5,17.27 20.95,17.72 20.97,17.72 v21.8,18.55 21.7,18.55
5  (via drill 0.25)
  Top 0.203: UC1.16 22.85,18.9 22.43,18.48 22.43,18.29 v21.75,17.61 v21.75,17.6
  Bottom 0.203: v21.75,17.6 21.7,17.65 21.3,17.25 U$3.9
6  (via drill 0.25)  (1 unrouted)
  Top 0.203: v22.25,16.9 22.88,17.53 22.88,18.16 23.22,18.51
  Bottom 0.203: U$3.16 16,16.56 16,16.15 16.2,15.95 18.49,15.95 19.08,15.36 19.23,15.36 20.13,15.34 20.42,15.05 20.94,15.05 21.02,15.13 | v22.25,16.9 21.8,16.45 21.8,15.9 21.02,15.13 | 21.02,15.12 21.02,15.13
7  (via drill 0.25)
  Top 0.203: UC1.14 23.94,18.55 23.95,18.55 23.95,19.35 v23.45,19.85
  Bottom 0.203: R23.2 R22.1 19.1,25.5 19.1,25.49 19.1,25.36 19.1,25.35 19.1,24.45 19.34,24.2 19.34,20.29 18.79,19.74 18.79,18.58 19.16,18.21 19.68,18.21 20.05,18.58 20.05,18.6 20.65,19.2 22.35,19.2 23,19.85 v23.45,19.85
10  (via drill 0.25)
  Top 0.203: UC1.11 24,14.94 24,14.15 23.95,14.1 v23.95,13.95
  Bottom 0.203: 21.3,12.15 U$3.8 21.31,11.63 21.31,10.39 21.73,10.8 22.76,10.8 22.76,10.86 23.12,11.22 23.12,11.96 23.49,12.33 23.58,12.33 23.95,12.7 v23.95,13.95
23_USBDP
  Top 0.203: R10.1 18.16,24.75 | 18.16,24.75 C11.2 | R7.1 16.8,24.64 17.66,24.64 17.77,24.75 18.16,24.75
24  (via drill 0.25)
  Top 0.203: v15,16.1 16.32,16.1 16.8,16.57 16.8,17.9 UC1.32
  Bottom 0.203: U$3.1 15.7,14.77 15.46,15.01 15.46,15.64 v15,16.1
24_USBDM
  Top 0.203: R6.1 C10.2
25  (via drill 0.25)
  Top 0.203: v16.04,15.32 16.68,15.95 17.15,16.42 17.15,18.25 UC1.31
  Bottom 0.203: U$3.2 16.5,14.88 16.32,15.06 16.32,15.28 16.25,15.35 16.08,15.35 v16.04,15.32
26  (via drill 0.25)
  Top 0.203: v16.95,15.32 17.51,15.87 17.51,18.6 UC1.30
  Bottom 0.203: U$3.3 17.3,13.57 17.13,13.74 17.13,14.26 17.25,14.38 17.25,15.02 v16.95,15.32
27  (via drill 0.25)
  Top 0.203: v17.76,14 17.76,14.39 17.59,14.57 17.59,15.38 17.86,15.66 17.86,18.96 UC1.29
  Bottom 0.203: U$3.4 18.1,13.11 17.95,13.27 17.95,13.95 17.85,14.05 17.82,14.05 v17.76,14
28  (via drill 0.25)
  Top 0.203: v18.58,13.53 18.58,14.08 17.94,14.71 17.94,15.24 18.22,15.51 18.22,19.31 UC1.28
  Bottom 0.203: U$3.5 18.9,13.45 18.7,13.65 v18.58,13.53
29  (via drill 0.25)
  Top 0.203: v18.57,14.98 18.57,19.66 UC1.27
  Bottom 0.203: U$3.6 19.7,13.3 18.57,14.43 v18.57,14.98
32  (via drill 0.25)  (2 unrouted)
  Top 0.203: UC1.45 UC1.44 15.94,12.68 15.34,12.68 | v14.95,11.15 14.85,11.3 15,10.85 15,9.41 14.45,8.85 14.12,8.85 v13.96,8.69
  Bottom 0.203: SJ1.1 15,12.57 15,11.15 | v13.96,8.69 13.96,8.2 13.61,7.85 13.61,6.37 R9.2
  other vias: 15.11,12.68
33  (via drill 0.25)
  Top 0.203: UC1.19 23.05,21.2 23.24,21.2 v23.3,21.27 | v21,23.41 20.79,23.41 20.5,23.7 19.25,23.7 18.87,23.32 18.87,22.73 18.85,22.71 18.85,22.45 18.7,22.3 v18.34,22.3
  Bottom 0.203: v23.3,21.27 22.55,22.02 22.55,22.66 21.62,22.66 21.14,23.15 21,23.15 v21,23.41 | v18.34,22.3 R1.2
+5V/2  (via drill 0.25)
  Top 0.203: R8.2 | 14.05,23.03 13.72,23.36 13.72,26.19 13.96,26.43 R8.2 | R8.2 14.57,26.23 v14.78,26.23
  Bottom 0.203: v14.78,26.23 15.23,26.23
AV+  (3 unrouted)
AV-  (via drill 0.25)  (4 unrouted)
  Top 0.203: L1.1 22.35,21.4 22.25,21.4 v22.25,21.34
  Bottom 0.203: 22.9,17.05 23.35,17.5 23.65,17.5 24.1,17.95 24.1,21.85 23.78,22.18 v23.32,22.18 | v22.25,21.34 21.89,21.7 C3.2
CLKIN1
  Top 0.203: SJ2.2 17.65,2.24 16.9,2.24 16.9,2.34 15.77,3.47 15.77,3.88 U1.1
DISC
  Top 0.203: R5.1 14.19,11.75 16.5,11.75 17.21,12.46 UC1.46
FSYNC1  (1 unrouted)
  Top 0.203: 23.1,2.52 22.6,3.01 22.6,5.46 22.83,5.69 22.83,6.21 22.46,6.58 21.94,6.58 21.71,6.35 20.2,6.35 19.8,6.75 U1.11 | U1.11
GND  (via drill 0.25, 0.35)  (9 unrouted)
  Top 0.203: SJ2.1 19.16,1.2 C12.1 20.38,1.34 C14.1 20.41,1.33 C13.1 22.66,1.33 22.92,1.07 | 23.1,1.04 22.95,1.04 22.92,1.07 | SJ3.1 23.1,1.25 22.92,1.07 | UC1.23 20.39,21.41 20.74,21.75 20.74,21.85 21.1,21.85 L1.2 21.88,22.38 22.64,23.14 22.99,23.14 23.18,23.33 23.18,26.07 22.85,26.4 22.85,26.28 | 14.41,18.19 UC1.35 13.68,18.9 13.68,21.53 14.3,22.15 v14.55,22.15 | UC1.47 17.1,11.71 17.1,10.17 17.03,10.1 v16.75,10.1 | R4.1 20.22,9.07 19.9,8.75 v19.85,8.8 | v23.71,16.8 23.16,16.8 22.23,15.88 21.24,15.88 21.01,15.65 20.75,15.75 v20.68,15.68 | v22.3,7.25 22.3,9.41 C8.2 | C10.1 17.12,26.55 C11.1 | 22.85,26.28 v22.9,26.23 | R11.1 22.55,26.59 22.85,26.28 | U1.18 15.75,8.7 15.75,8.69 v15.6,8.54
  Bottom 0.203: 20.12,8.35 19.9,8.35 19.9,8.75 v19.85,8.8 18.35,10.3 16.85,10.3 16.74,10.19 | 20.2,8.35 22.3,8.35 | 22.3,8.35 23.7,8.35 24.1,7.95 24.1,2.45 v22.8,1.15 | C8.2 22.27,8.38 22.3,8.35 | 13.7,18.85 13.7,20.55 | 13.7,20.55 13.7,27.15 18.3,27.15 | 22.34,26.45 PAD15.1 23,26.33 v22.9,26.23 | 22.34,26.45 22.2,26.45 21.5,27.15 18.3,27.15 | 21.48,25.58 21.48,25.59 | 22.34,26.45 21.48,25.59 | C9.2 v23.71,16.8 | v20.68,15.68 19.23,15.72 18.9,16.05 U$3.12 U$3.13 18.1,17.55 17.93,17.72 16.88,17.72 16.45,18.16 15.2,18.16 14.85,17.8 14.75,17.8 13.7,18.85 | v16.75,10.1 16.65,10.1 16.74,10.19 | C11.1 18.16,27.01 18.3,27.15 | 21.48,25.59 20.8,24.91 R23.1 | v14.55,22.15 15,22.15 PAD17.1 | D1.C 13.71,20.54 13.7,20.55 | v22.3,7.25 22.3,6.68 22.15,6.53 21.96,6.53 21.37,5.95 17.96,5.95 Q1.2 16.66,7.25 15.7,7.25 15.7,8.44 v15.6,8.54 15.56,8.5 14.76,8.5 14.32,8.05 R9.1 | 16.74,10.19 13.87,10.19 13.64,10.42 13.64,14.17 13.7,14.23 13.7,18.85
  other vias: 22.27,9.45 18.16,26.55
MOT1_IN1  (via drill 0.25)
  Bottom 0.305: U$1.9 3.7,16.3 3.7,16.78 3.91,16.99 3.91,22.56 4.37,23.02 8.77,23.02 IC4.2
  other vias: 10.01,24.26
MOT1_IN2  (via drill 0.25)
  Bottom 0.305: U$1.8 3.45,14.77 2.9,15.32 2.9,16.78 3.45,17.33 3.45,22.85 4.12,23.52 8.03,23.52 10.01,25.5 IC4.3
  other vias: 10.01,25.53
MOT2_IN1  (via drill 0.25)
  Bottom 0.305: IC6.2 5.67,18.71 5.05,18.1 U$1.11
  other vias: 10.01,18.71
MOT2_IN2  (via drill 0.25)
  Bottom 0.305: IC6.3 6.18,19.99 4.36,18.16 4.36,16.53 4.25,16.53 U$1.10
  other vias: 10.01,19.99
MOT3_IN1  (via drill 0.25)
  Top 0.203: v8.65,6.65 8.74,6.65 9,6.91 9.14,7.05 9.32,7.05 IC8.2
  Bottom 0.203: U$1.2 8.4,12.1 8.4,11.43 8.37,11.4 8.37,10.88 8.65,10.59 v8.65,6.65
MOT3_IN2  (via drill 0.25)
  Top 0.203: IC8.3 9.32,9.71 9.14,9.71 9,9.86 9,10.72 v9,11.14
  Bottom 0.203: v9,11.14 9.05,11.19 U$1.1
MOT4_IN1  (via drill 0.25)
  Top 0.203: v10.08,2.23 10.03,2.23 IC10.2
  Bottom 0.203: v10.08,2.23 9.37,2.94 9.37,4.16 9.6,4.39 9.6,4.6 9.01,5.19 8.66,5.55 8.36,5.55 7.66,6.24 7.66,7.06 7.94,7.34 7.94,10.3 7.4,10.84 7.4,11.09 7.1,11.39 6.95,11.54 6.95,11.95 U$1.4
MOT4_IN2  (via drill 0.25)
  Top 0.203: IC10.3 10.01,3.88 v10,3.89
  Bottom 0.203: v10,3.89 10,4.71 8.8,5.9 8.5,5.9 8.02,6.39 8.02,6.91 8.29,7.19 8.29,10.45 7.75,10.99 7.75,11.95 U$1.3
MOT5_IN1  (via drill 0.25)
  Bottom 0.203: U$1.5 6.15,12.55 6.15,12.96 6.85,13.66 9.6,13.66 IC12.2
  other vias: 10.01,13.24
MOT5_IN2  (via drill 0.25)
  Bottom 0.203: U$1.6 5.35,12.55 5.35,12.96 6.91,14.51 IC12.3
  other vias: 10.01,14.51
N$1  (via drill 0.25)  (1 unrouted)
  Top 0.203: 13.86,12.68 13.86,12.82 14.58,13.54 v14.58,13.78
  Bottom 0.203: R2.1 14.64,13.78 v14.58,13.78
N$2
  Bottom 0.203: R1.1 17.04,20.77 D1.A
N$3
  Top 0.203: R13.1 14.1,2.68 14.1,4.95 14.36,5.21 U1.23
N$4
  Top 0.203: SJ4.2 18.38,9.97 R4.2
N$5
  Top 0.203: U1.24 14.5,4.28 14.5,3.53 15,3.03 15,1.79 14.49,1.27 R14.1
N$7
  Top 0.203: U1.8 19.15,5.18 19.66,5.18 19.89,4.96 19.89,3.83 19.3,3.24 C12.2
N$8  (via drill 0.25)  (1 unrouted)
  Top 0.203: 21.51,2.66 21.5,2.65 C13.2 22.1,3.23 22.1,5.95 v22.2,5.95 | U1.20 14.9,6.78 14.48,6.78 14.16,7.1 14.16,7.41 14.5,7.75 15.05,7.75 15.05,7.87 v15,7.91
  Bottom 0.203: 23.58,7.54 23.58,6.83 23.2,6.45 22.7,6.45 v22.2,5.95 21.88,5.95 21.52,5.59 16.75,5.59 15.34,7 15.34,7.57 v15,7.91 | 23.61,7.54 23.2,7.95
N$9
  Top 0.203: C14.2 20.24,2.77 20.24,5.62 19.61,6.25 U1.10
N$10  (via drill 0.25)
  Top 0.203: U4.3 -7.5,-34.45 v-6.7,-33.65
  Bottom 0.203: v-6.7,-33.65 -6.7,-31.55 -7.7,-30.55 PAD13.1
N$11
  Top 0.61: IC12.8 4.54,11.97 4.19,11.99 PAD5.1
N$12
  Top 0.305: R16.2 4.57,18.7 IC6.7
N$13
  Top 0.61: IC12.6 4.49,14.51 | 4.49,14.51 | 4.49,14.51 PAD6.1
N$14
  Top 0.61: IC8.6 4.49,9.02 | 4.49,9.02 | 4.49,9.02 PAD2.1
N$15
  Top 0.61: IC8.8 4.54,6.48 4.14,6.5 PAD1.1
N$16  (via drill 0.25)
  Top 0.203: C15.1 -7.13,-36.27 -9.32,-36.27 -9.47,-36.12 -9.47,-34.04 -8.6,-33.17 U4.2 U4.1 -8.37,-32.05 -6.42,-32.05 v-6,-32.47
  Bottom 0.203: v-6,-32.47 -5.1,-32.47 -3.9,-31.27 PAD7.1
N$17
  Top 0.61: IC10.6 2.4,3.48 PAD8.1
N$18
  Top 0.61: IC10.8 PAD3.1
N$19
  Top 0.61: PAD12.1 4.57,20.01 IC6.6
N$20
  Top 0.61: IC6.8 4.49,17.45 | 4.49,17.45 | 4.49,17.45 4.49,17.44 PAD11.1
N$21
  Top 0.61: IC4.6 4.59,25.55 PAD10.1
N$22
  Top 0.61: PAD9.1 4.58,22.98 IC4.8
N$23
  Top 0.305: R17.2 4.58,2.2 IC10.7
N$24
  Top 0.305: R18.2 IC8.7
N$25
  Top 0.305: R19.2 IC12.7
N$26
  Top 0.305: R15.2 4.58,24.25 IC4.7
N$28  (via drill 0.25)
  Top 0.203: v19.4,14.52 19.42,18.13 19.4,18.15 19.4,18.82 v19.42,18.84
  Bottom 0.203: v19.42,18.84 19.42,19.86 19.69,20.14 19.69,24.79 R22.2 | v19.4,14.52 19.4,14.36 20.5,13.26 U$3.7
N$29  (via drill 0.25)
  Top 0.203: v-5.3,-31.65 -5.04,-31.91 U4.8 -3.85,-31.91 -7.67,-35.71 U4.4 -6.38,-35.71 C15.2
  Bottom 0.203: v-5.3,-31.65 -5.8,-31.15 PAD4.1
N$51
  Top 0.203: R10.2 19.48,24.49 Q2.2
N$59  (via drill 0.25)
  Top 0.203: R6.2 14.18,25.06 v14.35,25.06
  Bottom 0.203: PAD19.1 14.95,25.1 14.46,25.1 v14.35,25.06
N$60  (via drill 0.25)
  Top 0.203: R7.2 15.25,23.99 v15.25,23.6
  Bottom 0.203: PAD20.1 v15.25,23.6
N$71  (2 unrouted)
  Top 0.203: R8.1 16.05,26.43 16.57,25.92 19.05,25.92 Q2.1 19.64,26.51 20.74,26.51
N$73  (via drill 0.35)
  Top 0.203: R5.2 13.96,9.52 13.95,9.5 v13.95,9.55
  Bottom 0.203: R12.1 19.13,7.18 Q1.1 17.63,8.17 17.32,8.17 17.18,8.32 17.18,8.77 16.39,9.55 v13.95,9.55
OSC_IN  (via drill 0.25)
  Top 0.203: OSC.3 21.64,8.4 21.64,10.07 21.93,10.37 21.93,12.07 21.81,12.19 21.81,12.88 UC1.5 21.42,13.24 20.71,13.95 20.71,14.15 v20.7,14.15
  Bottom 0.203: C9.1 23.71,14.61 23.3,14.2 23.3,13.95 22.3,12.95 21.9,12.95 v20.7,14.15
OSC_OUT
  Top 0.203: OSC.1 23.41,6.01 24.21,6.82 24.21,8.93 23.69,9.45 C8.1 23.49,9.45 22.29,10.64 22.29,12.21 22.17,12.34 22.17,12.86 22.29,12.99 22.29,13.11 UC1.6
PWR_GND  (via drill 0.25, 0.45)
  Top 0.203: v1.65,2.2 R17.1
  Top 0.305: IC4.9 v6.8,24.2 | v5.88,16.05 5.88,15.3 IC12.9 6.65,13.88 U$1.13
  Top 0.61: 7.3,11.97 IC12.9 7.3,17.45 | 7.3,17.45 IC6.9 7.3,22.99 | 7.3,22.99 IC4.9 | 7.3,5.4 IC10.9 7.3,1.7 8.06,0.94 IC10.1 | 7.3,11.97 IC8.9 7.25,8.33 7.25,5.4 7.3,5.4 | v10,11.15 IC12.1 7.3,11.97 | IC6.1 7.3,17.45 | IC4.1 7.3,22.99 | IC8.1 9.97,6.44 9.65,6.44 8.62,5.4 7.3,5.4
  Top 1.016: IC4.9 7.3,26.45 | v6.05,25.55 v6.04,25.55 v6.04,26.47 7.3,26.47 7.3,26.45 | v7.1,26.45 7.3,26.45
  Bottom 0.203: GND.1 5.42,26.47 v6.04,26.47
  Bottom 0.305: 6.75,24.25 v6.8,24.2 6.8,24.25 R15.1 1.99,24.24 1.99,18.71 R16.1 R19.1 2,11.2 1.37,10.57 1.37,10 2,9.37 R18.1 1.45,7.2 1.45,2.2 v1.65,2.2 | U$1.12 v5.88,16.05
  Bottom 0.61: IC5.5 9.99,11.09 10,11.1 v10,11.15 | 7.1,26.3 v7.1,25.55 v6.05,25.55 6.05,26.46 v6.04,26.47 7.08,26.47 v7.1,26.45 | 7.1,26.3 | 7.1,26.3 v7.1,26.45 | v7.1,26.45
  other vias: 2,24.25 2,18.7 2,13.25 2,7.75 6.65,16.05
PWR_VCC  (via drill 0.25)
  Top 0.203: IC6.4 8.1,21.25 | 10.55,26.8 IC4.4 10.55,26.8
  Top 0.305: 11.15,10.3 11.15,15.85 | 11.15,15.85 11.15,21.2 | IC6.4 11.1,21.26 11.15,21.2 | U$1.15 8.52,15.78 IC12.4 10.01,15.85 11.15,15.85 | IC8.4 11.15,10.3 | 11.15,10.3 11.15,4.9 11,4.75 IC10.4 v10,5.6 | 11.15,21.2 11.15,26.35 10.7,26.8 IC4.4
  Bottom 0.203: v10,5.6 IC5.8
  Bottom 0.305: v9.99,5.61 v10,5.6 | U$1.14 U$1.15
  other vias: 8.25,16.05
RESET  (via drill 0.25)
  Top 0.203: SJ4.1 19.4,10.62 19.8,10.62 v19.8,10.52 | 23.5,11.95 23.52,11.93 23.52,11.88 23.7,11.7 R3.1 23.75,12.36 UC1.7
  Bottom 0.203: v19.8,10.52 20.51,9.81 21.23,9.81 21.86,10.43 22.9,10.43 23.12,10.65 23.12,10.71 23.58,11.17 23.58,11.65 23.63,11.7 R3.1
  other vias: 23.75,11.7
VBAT_CUR  (via drill 0.35)
  Top 0.61: IC4.5 1,26.8 0.65,26.45 0.65,21.25 | 0.65,21.25 0.65,15.8 | IC6.5 0.65,21.25 | IC12.5 4.15,15.78 4.15,15.8 0.65,15.8 | 0.65,15.8 0.65,10.35 | 0.65,10.35 0.65,5.45 1.35,4.75 IC10.5 | 0.65,10.35 arc90 0.71,10.29 v3.3,10.29 IC8.5
  Bottom 0.203: IC5.4 4.25,10.61 U$1.7
  Bottom 0.61: IC5.3 IC5.4 v3.3,10.29 | 3.3,10.25 v3.3,10.29 | v3.3,10.29 v2.7,10.29 v2.05,10.29
VBAT_IN  (1 unrouted)
  Bottom 0.61: IC5.2 IC5.1
  Bottom 1.016: 3.38,3.15 3.92,3.15 3.92,7.1 IC5.2
VCC  (via drill 0.25, 0.25 pad 0.25)  (6 unrouted)
  Top 0.203: R13.2 15.7,1.29 R14.2 14.99,0.57 13.94,0.57 13.69,0.82 13.69,7.59 15.42,9.32 16.8,9.32 17.6,10.12 | 18.3,8.2 18.3,8.67 17.6,9.37 17.6,10.12 | 18.3,8.2 U1.13 | UC1.24 20.04,21.56 19.7,21.21 19.7,19.95 v20.05,19.6 20.05,13.96 UC1.48 | UC1.48 18,11.75 | UC1.48 17.6,11.51 17.6,10.12 | 23.75,10.51 v23.75,10.45 R3.2 | v14.35,16.69 14.03,17.01 UC1.36 | Q2.3 22.37,24.8 22.4,24.8 v22.35,24.85 | v19.05,8.3 18.4,8.3 18.3,8.2
  Bottom 0.203: 20,19.65 v20.05,19.6 20.05,22.8 20.37,23.12 20.37,23.67 20.74,24.04 21.22,24.04 22.04,24.85 v22.35,24.85 22.5,25 PAD16.1 | U$3.14 U$3.15 16.5,17.6 16.3,17.8 15.35,17.8 14.3,16.75 14.3,16.74 v14.35,16.69 14.06,16.4 14.06,15.1 | v23.75,10.45 23.75,10.37 23.46,10.08 22.01,10.08 21.38,9.45 20,9.45 18.72,10.73 16.09,10.73 15.9,10.54 14.31,10.54 13.99,10.86 13.99,14.02 14.06,14.08 14.06,15.1 | R2.2 14.26,14.9 14.06,15.1 | R12.2 20.27,7.99 19.75,7.99 19.5,8.25 19.1,8.25 v19.05,8.3
VIN  (via drill 0.25)  (2 unrouted)
  Top 0.203: 14.35,21.05 15.18,21.89 15.18,22.68 15.4,22.9 15.53,22.9 16.07,23.45 17,23.45 17.27,23.71 v17.27,23.83
  Bottom 0.203: v17.27,23.83 17.37,23.83 C1.A
VIOUT
  Bottom 0.305: IC5.7 10.04,7.8 10.6,7.8 11.15,8.35 11.15,14.5 10.4,15.25 9.85,15.25 U$1.16